# EAGLE schematic Main_board_rev2 (EAGLE 7.3.0)
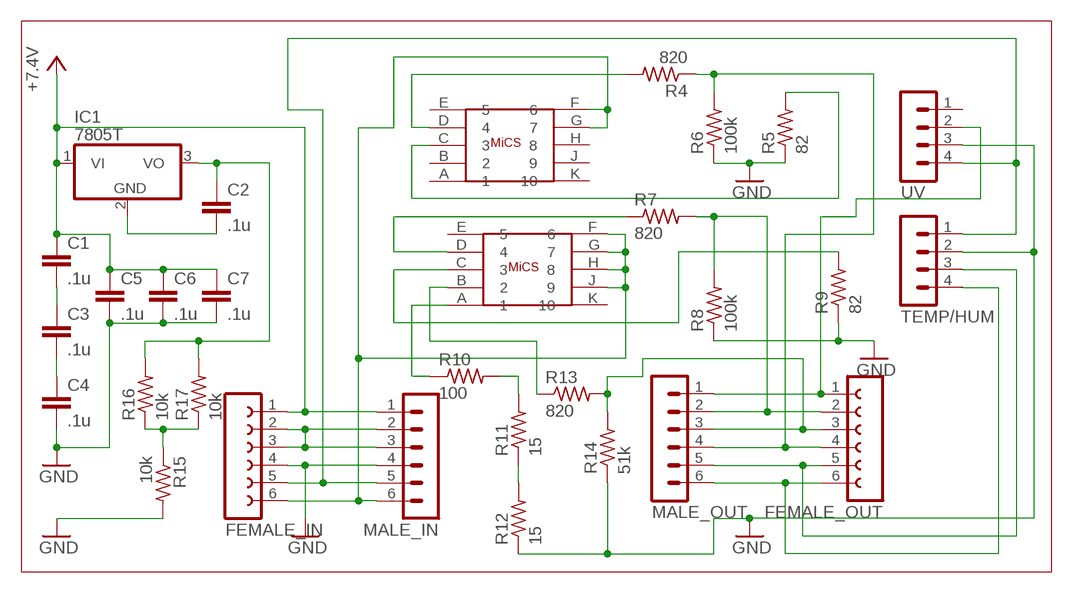
[diagram p0: schematic, sheet 1]

## Parts
2614  MICS_SMD  [MICS_SOCKET]
4514  MICS_SMD  [MICS_SOCKET]
C1  .1u  C2,5-3  [C2.5-3]
C2  .1u  C2,5-3  [C2.5-3]
C3  .1u  C2,5-3  [C2.5-3]
C4  .1u  C2,5-3  [C2.5-3]
C5  .1u  C2,5-3  [C2.5-3]
C6  .1u  C2,5-3  [C2.5-3]
C7  .1u  C2,5-3  [C2.5-3]
FEMALE_IN  FE06W  [FE06W]
FEMALE_OUT  FE06W  [FE06W]
IC1  7805T  [TO220H]
MALE_IN  MA06-1  [MA06-1]
MALE_OUT  MA06-1  [MA06-1]
R4  820  R-US_0204/7  [0204/7]
R5  82  R-US_0204/7  [0204/7]
R6  100k  R-US_0204/7  [0204/7]
R7  820  R-US_0204/7  [0204/7]
R8  100k  R-US_0204/7  [0204/7]
R9  82  R-US_0204/7  [0204/7]
R10  100  R-US_0204/7  [0204/7]
R11  15  R-US_0204/7  [0204/7]
R12  15  R-US_0204/7  [0204/7]
R13  820  R-US_0204/7  [0204/7]
R14  51k  R-US_0204/7  [0204/7]
R15  10k  R-US_0204/7  [0204/7]
R16  10k  R-US_0204/7  [0204/7]
R17  10k  R-US_0204/7  [0204/7]
TEMP/HUM  MA04-1  [MA04-1]
UV  MA04-1  [MA04-1]

## Nets
+5V: C1.1 C5.1 C6.1 C7.1 FEMALE_IN.1 IC1.1(VI) MALE_IN.1 ; supply symbol labelled +7.4V
GND: C4.2 C5.2 C6.2 C7.2 FEMALE_IN.4 MALE_IN.4 R5.1 R6.1 R8.1 R9.1 R12.1 R14.1 R15.2 TEMP/HUM.2 UV.3
N$1: C2.1 IC1.3(VO) R16.2 R17.2
N$2: C2.2 IC1.2(GND)
N$3: R15.1 R16.1 R17.1
N$4: C3.2 C4.1
N$5: C1.2 C3.1
N$6: FEMALE_OUT.4 MALE_OUT.4 R4.1 R6.2
N$7: 2614.C R5.2
N$8: FEMALE_IN.2 FEMALE_IN.3 MALE_IN.2 MALE_IN.3
N$9: 2614.D R4.2
N$10: FEMALE_OUT.2 MALE_OUT.2 R7.2 R8.2
N$11: 4514.C R9.2
N$12: 4514.D R7.1
N$13: R10.2 R11.2
N$14: R11.1 R12.2
N$15: 4514.A R10.1
N$16: FEMALE_OUT.3 MALE_OUT.3 R13.2 R14.2
N$17: 4514.B R13.1
N$18: FEMALE_OUT.1 MALE_OUT.1 UV.2
N$19: FEMALE_IN.5 MALE_IN.5 TEMP/HUM.1 UV.4
N$20: 2614.F 2614.G 4514.F 4514.G 4514.H 4514.J FEMALE_IN.6 MALE_IN.6
N$22: FEMALE_OUT.5 MALE_OUT.5 TEMP/HUM.3
N$23: FEMALE_OUT.6 MALE_OUT.6 TEMP/HUM.4
Unconnected: 2614.A 2614.B 2614.E 2614.H 2614.J 2614.K 4514.E 4514.K UV.1

## Library data of the parts
2614 4514 = MiCS_socket:MICS_SMD: MiCS
C1-C7 = capacitor-wima:C: CAPACITOR naming: grid - package width
FEMALE_IN FEMALE_OUT = con-lsta:FE06W: FEMALE HEADER; OC_FARNELL: unknown; OC_NEWARK: unknown
IC1 = linear:78*: Positive VOLTAGE REGULATOR Source: http://cache.national.com/ds/LM/LM78L05.pdf http://www.fairchildsemi.com/ds/LM/LM7805.pdf
MALE_IN MALE_OUT = con-lstb:MA06-1: PIN HEADER; OC_FARNELL: unknown; OC_NEWARK: unknown
R4-R14 = rcl:R-US_: RESISTOR, American symbol
R15-R17 = resistor:R-US_: RESISTOR, American symbol
TEMP/HUM UV = con-lstb:MA04-1: PIN HEADER; OC_FARNELL: unknown; OC_NEWARK: unknown

## Net classes
0 default: width 0.305 mm, drill 0.508 mm, clearance 0.254 mm